# EAGLE design Custom USB_N64_smaller (EAGLE 9.1.3)
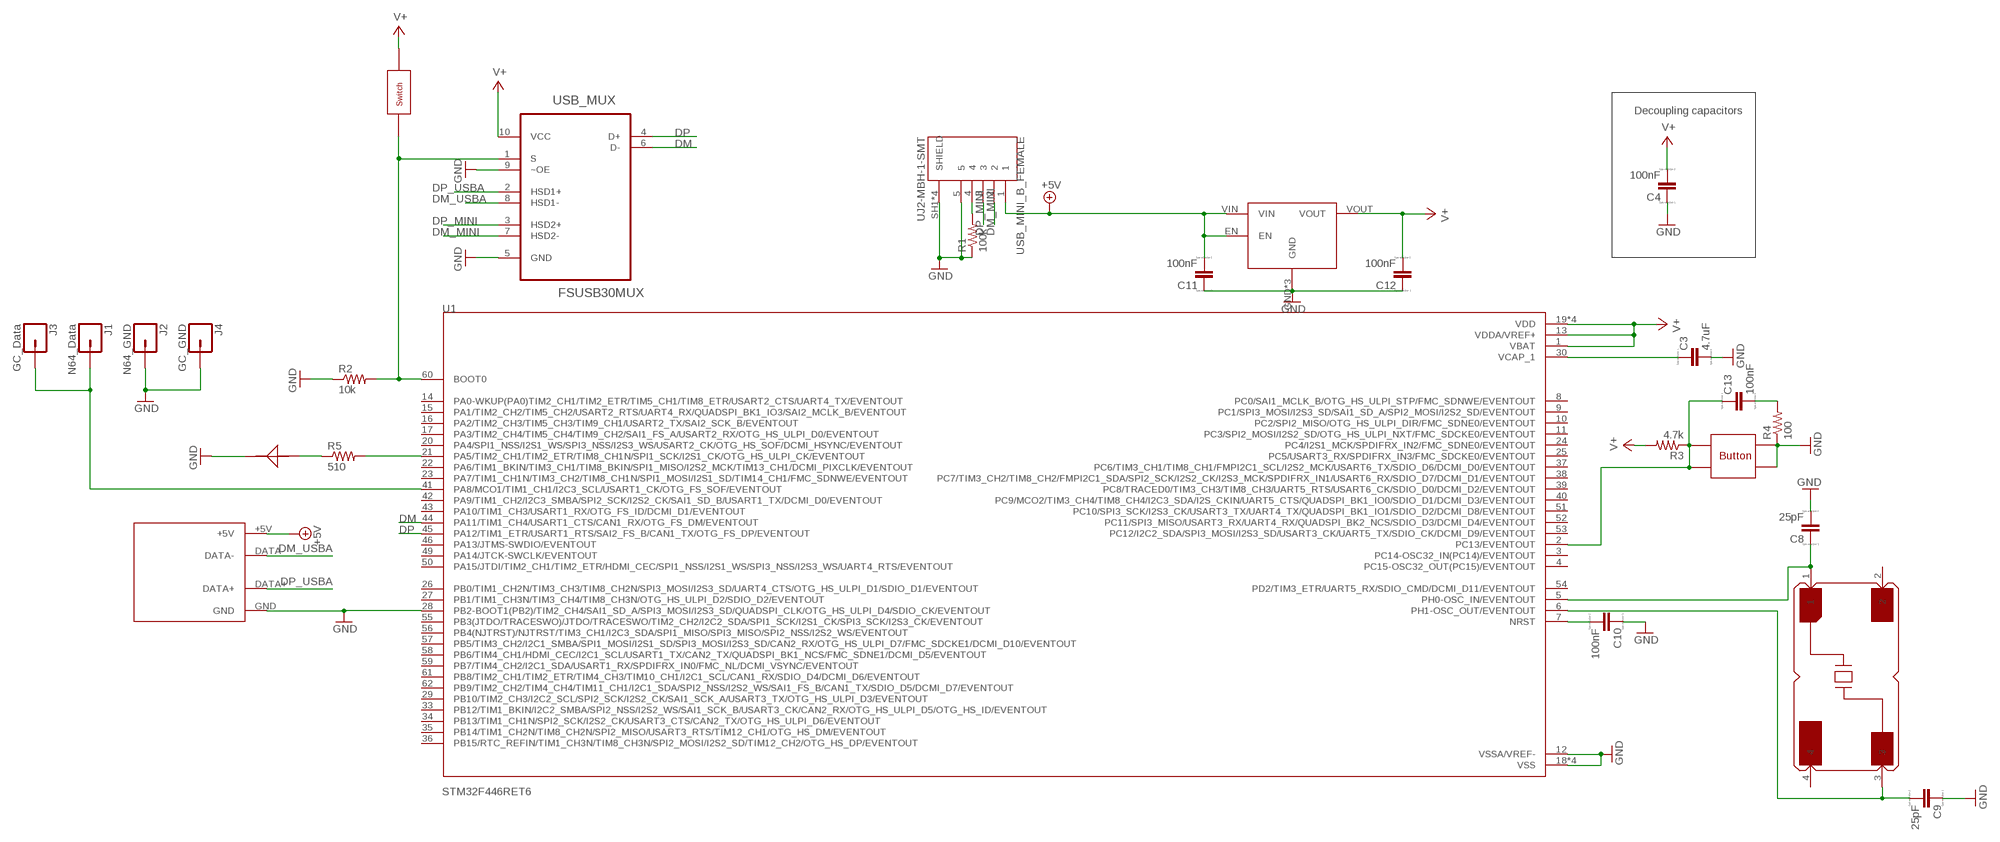
[diagram p0: schematic, sheet 1]

## Parts
C3  4.7uF  C  [C0805]
C4  100nF  C  [C0805]
C8  25pF  C  [C0805]
C9  25pF  C  [C0805]
C10  100nF  C  [C0805]
C11  100nF  C  [C0805]
C12  100nF  C  [C0805]
C13  100nF  C  [C0805]
CHANGE_CONTROLS  PUSHBUTTON  [PUSHBUTTON]
J1  N64_Data  M01PTH  [1X01]
J2  N64_GND  M01PTH  [1X01]
J3  GC_Data  M01PTH  [1X01]
J4  GC_GND  M01PTH  [1X01]
R1  100k  R-US_R0805  [R0805]
R2  10k  R-US_R0805  [R0805]
R3  4.7k  R-US_R0805  [R0805]
R4  100  R-US_R0805  [R0805]
R5  510  R-US_R0805  [R0805]
SWITCH  DM01  [DM01]
U1  STM32F446RET6  [QFP50P1200X1200X160-64N]
U$6  17-21SYGC/S530-E2/TR8  [17-21SYGC/S530-E2/TR8]
USB_A_FEMALE  USB_A_F  [USB_A_F]
USB_MINI_B_FEMALE  UJ2-MBH-1-SMT  [CUI_UJ2-MBH-1-SMT]
USB_MUX  FSUSB30MUX  [SOP50P490X110-10N]
V_REG  S-1172B33-U5T1G  [S-1172B33-U5T1G]
XTAL_HSE  ABMM-8.000MHZ-B2-T  [DFN-4]

## Nets
3V3: C4.2 C12.2 R3.2 SWITCH.P$1 U1.1(VBAT) U1.13(VDDA/VREF+) U1.19(VDD) U1.32(VDD) U1.48(VDD) U1.64(VDD) USB_MUX.10(VCC) V_REG.VOUT ; supply symbol labelled V+
+5V: C11.2 USB_A_FEMALE.+5V USB_MINI_B_FEMALE.1 V_REG.EN V_REG.VIN
DM: U1.44(PA11/TIM1_CH4/USART1_CTS/CAN1_RX/OTG_FS_DM/EVENTOUT) USB_MUX.6(D-)
DM_MINI: USB_MINI_B_FEMALE.2 USB_MUX.7(HSD2-)
DM_USBA: USB_A_FEMALE.DATA- USB_MUX.8(HSD1-)
DP: U1.45(PA12/TIM1_ETR/USART1_RTS/SAI2_FS_B/CAN1_TX/OTG_FS_DP/EVENTOUT) USB_MUX.4(D+)
DP_MINI: USB_MINI_B_FEMALE.3 USB_MUX.3(HSD2+)
DP_USBA: USB_A_FEMALE.DATA+ USB_MUX.2(HSD1+)
GND: C3.2 C4.1 C8.2 C9.1 C10.1 C11.1 C12.1 CHANGE_CONTROLS.P$3 CHANGE_CONTROLS.P$4 J2.1 J4.1 R1.1 R2.1 R4.1 U1.12(VSSA/VREF-) U1.18(VSS) U1.28(PB2-BOOT1(PB2)/TIM2_CH4/SAI1_SD_A/SPI3_MOSI/I2S3_SD/QUADSPI_CLK/OTG_HS_ULPI_D4/SDIO_CK/EVENTOUT) U1.31(VSS) U1.47(VSS) U1.63(VSS) U$6.NEG USB_A_FEMALE.GND USB_MINI_B_FEMALE.5 USB_MINI_B_FEMALE.SH1(SHIELD) USB_MINI_B_FEMALE.SH2(SHIELD) USB_MINI_B_FEMALE.SH3(SHIELD) USB_MINI_B_FEMALE.SH4(SHIELD) USB_MUX.5(GND) USB_MUX.9(~OE) V_REG.GND V_REG.GND2(GND) V_REG.GND3(GND)
N$3: R2.2 SWITCH.P$2 U1.60(BOOT0) USB_MUX.1(S)
N$4: C10.2 U1.7(NRST)
N$5: C8.1 U1.5(PH0-OSC_IN/EVENTOUT) XTAL_HSE.1
N$6: C3.1 U1.30(VCAP_1)
N$7: C9.2 U1.6(PH1-OSC_OUT/EVENTOUT) XTAL_HSE.3
N$8: J1.1 J3.1 U1.41(PA8/MCO1/TIM1_CH1/I2C3_SCL/USART1_CK/OTG_FS_SOF/EVENTOUT)
N$10: C13.1 CHANGE_CONTROLS.P$1 CHANGE_CONTROLS.P$2 R3.1 U1.2(PC13/EVENTOUT)
N$11: R5.2 U1.21(PA5/TIM2_CH1/TIM2_ETR/TIM8_CH1N/SPI1_SCK/I2S1_CK/OTG_HS_ULPI_CK/EVENTOUT)
N$12: C13.2 R4.2
N$13: R5.1 U$6.POS
N$15: R1.2 USB_MINI_B_FEMALE.4
Unconnected: U1.3(PC14-OSC32_IN(PC14)/EVENTOUT) U1.4(PC15-OSC32_OUT(PC15)/EVENTOUT) U1.8(PC0/SAI1_MCLK_B/OTG_HS_ULPI_STP/FMC_SDNWE/EVENTOUT) U1.9(PC1/SPI3_MOSI/I2S3_SD/SAI1_SD_A/SPI2_MOSI/I2S2_SD/EVENTOUT) U1.10(PC2/SPI2_MISO/OTG_HS_ULPI_DIR/FMC_SDNE0/EVENTOUT) U1.11(PC3/SPI2_MOSI/I2S2_SD/OTG_HS_ULPI_NXT/FMC_SDCKE0/EVENTOUT) U1.14(PA0-WKUP(PA0)TIM2_CH1/TIM2_ETR/TIM5_CH1/TIM8_ETR/USART2_CTS/UART4_TX/EVENTOUT) U1.15(PA1/TIM2_CH2/TIM5_CH2/USART2_RTS/UART4_RX/QUADSPI_BK1_IO3/SAI2_MCLK_B/EVENTOUT) U1.16(PA2/TIM2_CH3/TIM5_CH3/TIM9_CH1/USART2_TX/SAI2_SCK_B/EVENTOUT) U1.17(PA3/TIM2_CH4/TIM5_CH4/TIM9_CH2/SAI1_FS_A/USART2_RX/OTG_HS_ULPI_D0/EVENTOUT) U1.20(PA4/SPI1_NSS/I2S1_WS/SPI3_NSS/I2S3_WS/USART2_CK/OTG_HS_SOF/DCMI_HSYNC/EVENTOUT) U1.22(PA6/TIM1_BKIN/TIM3_CH1/TIM8_BKIN/SPI1_MISO/I2S2_MCK/TIM13_CH1/DCMI_PIXCLK/EVENTOUT) U1.23(PA7/TIM1_CH1N/TIM3_CH2/TIM8_CH1N/SPI1_MOSI/I2S1_SD/TIM14_CH1/FMC_SDNWE/EVENTOUT) U1.24(PC4/I2S1_MCK/SPDIFRX_IN2/FMC_SDNE0/EVENTOUT) U1.25(PC5/USART3_RX/SPDIFRX_IN3/FMC_SDCKE0/EVENTOUT) U1.26(PB0/TIM1_CH2N/TIM3_CH3/TIM8_CH2N/SPI3_MOSI/I2S3_SD/UART4_CTS/OTG_HS_ULPI_D1/SDIO_D1/EVENTOUT) U1.27(PB1/TIM1_CH3N/TIM3_CH4/TIM8_CH3N/OTG_HS_ULPI_D2/SDIO_D2/EVENTOUT) U1.29(PB10/TIM2_CH3/I2C2_SCL/SPI2_SCK/I2S2_CK/SAI1_SCK_A/USART3_TX/OTG_HS_ULPI_D3/EVENTOUT) U1.33(PB12/TIM1_BKIN/I2C2_SMBA/SPI2_NSS/I2S2_WS/SAI1_SCK_B/USART3_CK/CAN2_RX/OTG_HS_ULPI_D5/OTG_HS_ID/EVENTOUT) U1.34(PB13/TIM1_CH1N/SPI2_SCK/I2S2_CK/USART3_CTS/CAN2_TX/OTG_HS_ULPI_D6/EVENTOUT) U1.35(PB14/TIM1_CH2N/TIM8_CH2N/SPI2_MISO/USART3_RTS/TIM12_CH1/OTG_HS_DM/EVENTOUT) U1.36(PB15/RTC_REFIN/TIM1_CH3N/TIM8_CH3N/SPI2_MOSI/I2S2_SD/TIM12_CH2/OTG_HS_DP/EVENTOUT) U1.37(PC6/TIM3_CH1/TIM8_CH1/FMPI2C1_SCL/I2S2_MCK/USART6_TX/SDIO_D6/DCMI_D0/EVENTOUT) U1.38(PC7/TIM3_CH2/TIM8_CH2/FMPI2C1_SDA/SPI2_SCK/I2S2_CK/I2S3_MCK/SPDIFRX_IN1/USART6_RX/SDIO_D7/DCMI_D1/EVENTOUT) U1.39(PC8/TRACED0/TIM3_CH3/TIM8_CH3/UART5_RTS/USART6_CK/SDIO_D0/DCMI_D2/EVENTOUT) U1.40(PC9/MCO2/TIM3_CH4/TIM8_CH4/I2C3_SDA/I2S_CKIN/UART5_CTS/QUADSPI_BK1_IO0/SDIO_D1/DCMI_D3/EVENTOUT) U1.42(PA9/TIM1_CH2/I2C3_SMBA/SPI2_SCK/I2S2_CK/SAI1_SD_B/USART1_TX/DCMI_D0/EVENTOUT) U1.43(PA10/TIM1_CH3/USART1_RX/OTG_FS_ID/DCMI_D1/EVENTOUT) U1.46(PA13/JTMS-SWDIO/EVENTOUT) U1.49(PA14/JTCK-SWCLK/EVENTOUT) U1.50(PA15/JTDI/TIM2_CH1/TIM2_ETR/HDMI_CEC/SPI1_NSS/I2S1_WS/SPI3_NSS/I2S3_WS/UART4_RTS/EVENTOUT) U1.51(PC10/SPI3_SCK/I2S3_CK/USART3_TX/UART4_TX/QUADSPI_BK1_IO1/SDIO_D2/DCMI_D8/EVENTOUT) U1.52(PC11/SPI3_MISO/USART3_RX/UART4_RX/QUADSPI_BK2_NCS/SDIO_D3/DCMI_D4/EVENTOUT) U1.53(PC12/I2C2_SDA/SPI3_MOSI/I2S3_SD/USART3_CK/UART5_TX/SDIO_CK/DCMI_D9/EVENTOUT) U1.54(PD2/TIM3_ETR/UART5_RX/SDIO_CMD/DCMI_D11/EVENTOUT) U1.55(PB3(JTDO/TRACESWO)/JTDO/TRACESWO/TIM2_CH2/I2C2_SDA/SPI1_SCK/I2S1_CK/SPI3_SCK/I2S3_CK/EVENTOUT) U1.56(PB4(NJTRST)/NJTRST/TIM3_CH1/I2C3_SDA/SPI1_MISO/SPI3_MISO/SPI2_NSS/I2S2_WS/EVENTOUT) U1.57(PB5/TIM3_CH2/I2C1_SMBA/SPI1_MOSI/I2S1_SD/SPI3_MOSI/I2S3_SD/CAN2_RX/OTG_HS_ULPI_D7/FMC_SDCKE1/DCMI_D10/EVENTOUT) U1.58(PB6/TIM4_CH1/HDMI_CEC/I2C1_SCL/USART1_TX/CAN2_TX/QUADSPI_BK1_NCS/FMC_SDNE1/DCMI_D5/EVENTOUT) U1.59(PB7/TIM4_CH2/I2C1_SDA/USART1_RX/SPDIFRX_IN0/FMC_NL/DCMI_VSYNC/EVENTOUT) U1.61(PB8/TIM2_CH1/TIM2_ETR/TIM4_CH3/TIM10_CH1/I2C1_SCL/CAN1_RX/SDIO_D4/DCMI_D6/EVENTOUT) U1.62(PB9/TIM2_CH2/TIM4_CH4/TIM11_CH1/I2C1_SDA/SPI2_NSS/I2S2_WS/SAI1_FS_B/CAN1_TX/SDIO_D5/DCMI_D7/EVENTOUT) XTAL_HSE.2 XTAL_HSE.4

## Notes on the sheet
- Decoupling capacitors

## Library data of the parts
C3 C4 C8-C13 = eagle-ltspice:C: CAPACITOR, European symbol; SPICEMODEL: NONE; SPICEPREFIX: C
CHANGE_CONTROLS = pushbutton:PUSHBUTTON: LL3301NF065QG
J1-J4 = SparkFun-Connectors:M01: Header 1 Standard 1-pin 0.1" header. Use with straight break away headers (SKU : PRT-00116), right angle break away headers (PRT-00553), swiss pins (PRT-00743), machine pins (PRT-00117), and female headers (PRT-00115). SMTSO-256-ET is a "flush mount" nut for a 4-40 screw. The older package used to be too tight, and did not allow it to sit properly thru the drill hit. The latest (0.165DIA) fits nice and snug.
R1-R5 = rcl:R-US_: RESISTOR, American symbol; SPICEPREFIX: R
SWITCH = DM01:DM01
U1 = STM32F446RET6:STM32F446RET6: MCU 32-Bit STM32 ARM Cortex M4 RISC 512KB Flash 2.5V/3.3V 64-Pin LQFP Tray; DESCRIPTION: MCU 32-Bit STM32 ARM Cortex M4 RISC 512KB Flash 2.5V/3.3V 64-Pin LQFP Tray; MF: STMicroelectronics; MP: STM32F446RET6; PACKAGE: LQFP-64 STMicroelectronics
U$6 = LED_0805:17-21SYGC/S530-E2/TR8
USB_A_FEMALE = nucleo64:USB_A_F
USB_MINI_B_FEMALE = UJ2-MBH-1-SMT:UJ2-MBH-1-SMT: 3 µin Plating Thickness, Black Insulator, USB Receptacle; AVAILABILITY: Good; DESCRIPTION: Conn Mini USB Type B F 5 POS 0.8mm Solder RA SMD 5 Terminal 1 Port T/R; MF: CUI; MP: UJ2-MBH-1-SMT-TR; PACKAGE: None; PRICE: 0.29 USD
USB_MUX = FSUSB30MUX:FSUSB30MUX: Low Power teo port High speed USB 2.0 Switch; AVAILABILITY: Unavailable; DESCRIPTION: FSUSB30 Series DPDT 4.3 V 480 Mbps SMT Hi Speed USB 2.0 Switch - MSOP-10; MF: ON Semiconductor; MP: FSUSB30MUX; PACKAGE: MSOP-10 ON Semiconductor; PRICE: None
V_REG = S-1172B33-U5T1G:S-1172B33-U5T1G
XTAL_HSE = ABMM-8.000MHZ-B2-T:ABMM-8.000MHZ-B2-T: CRYSTAL 24MHZ 18PF SMD; AVAILABILITY: Good; DESCRIPTION: Crystal 8MHz ??20ppm _Tol_ ??50ppm _Stability_ 18pF FUND 70Ohm 4-Pin CSMD T/R; MF: Abracon; MP: ABMM-8.000MHZ-B2-T; PACKAGE: SMD-4 Abracon; PRICE: 0.61 USD

## Board
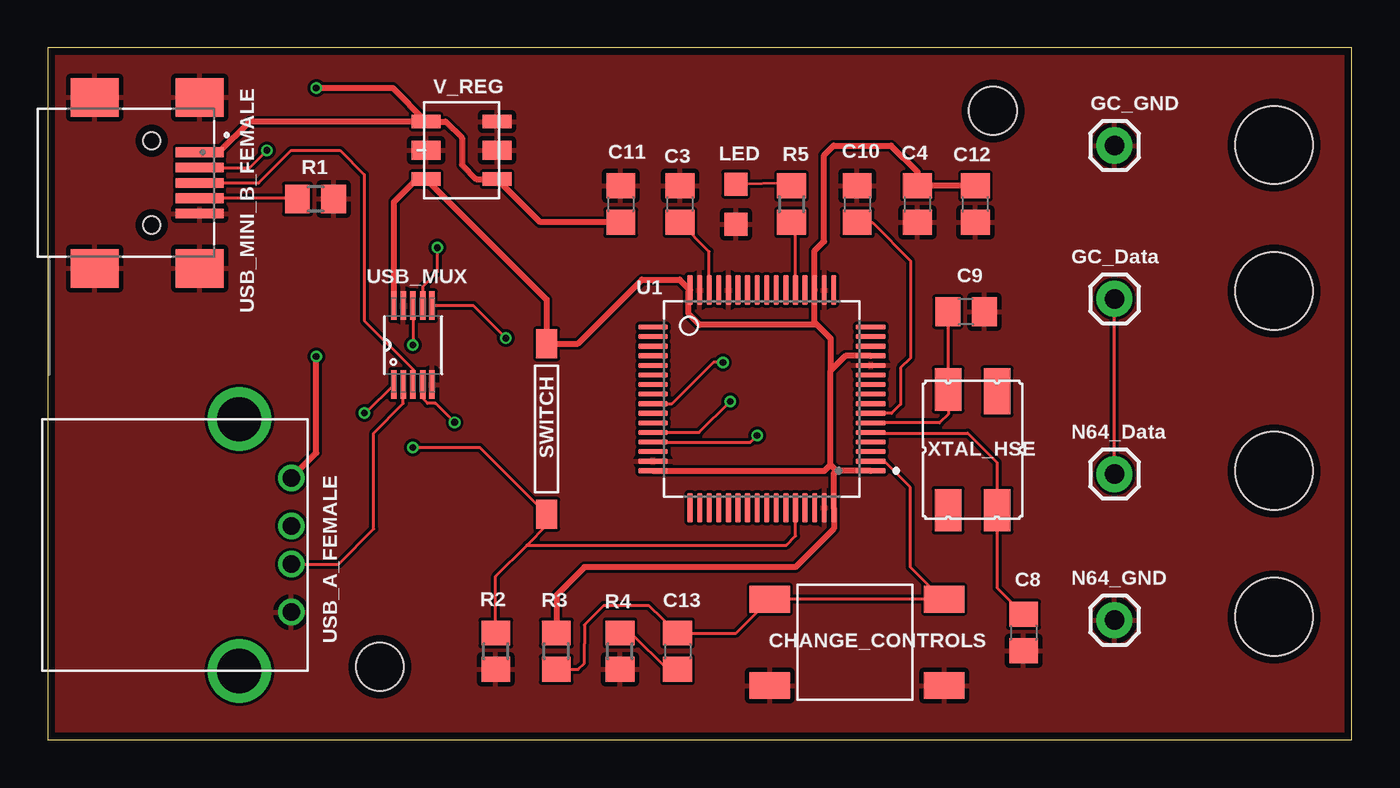
[diagram p1: board, top side]
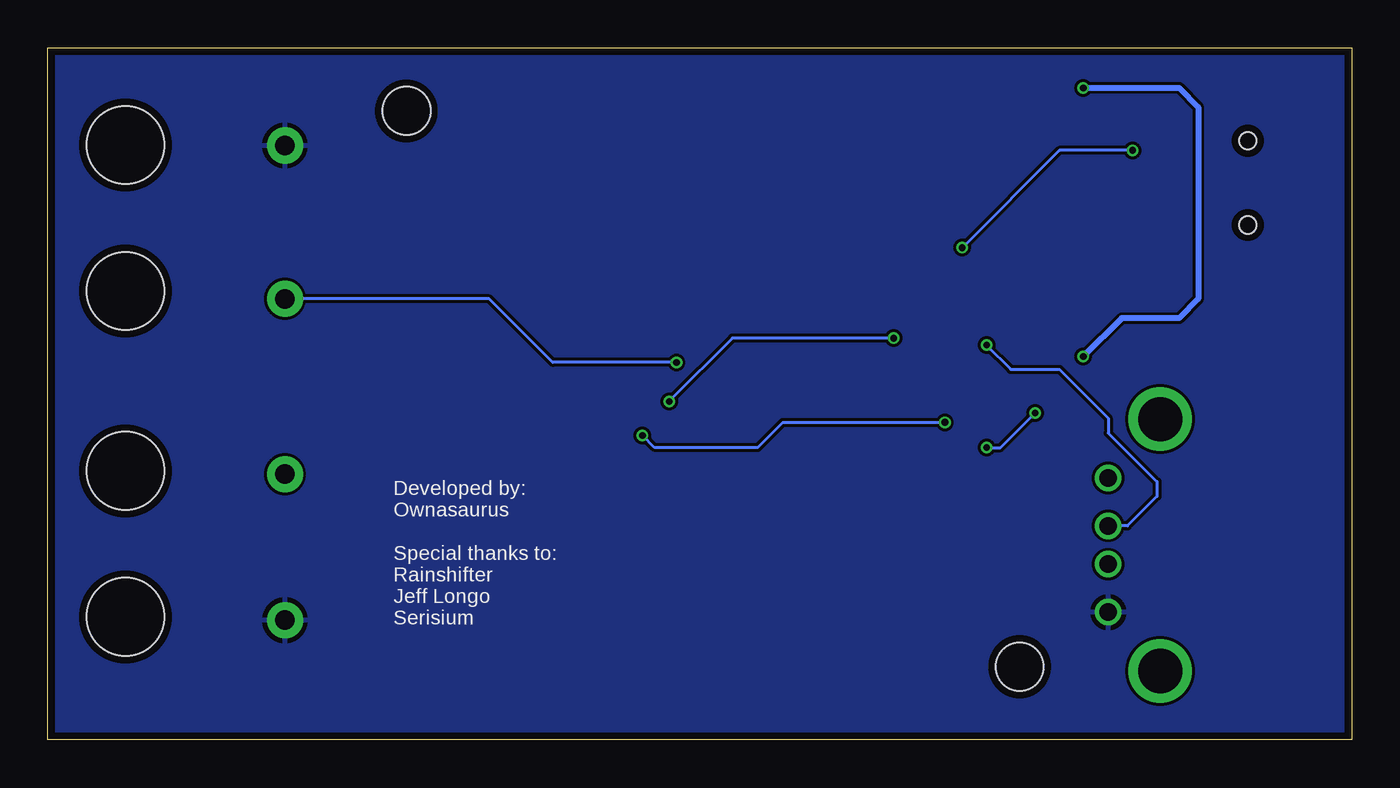
[diagram p2: board, bottom side, seen from below]

Size 68.03 x 36.09 mm. Coordinates in mm from the lower left corner, seen from the top.
Outline: 0,0 68.03,0 68.03,36.09 0,36.09 0,0
Copper layers (1*16): Top 0.035559375mm / dielectric 1.6mm / Bottom 0.035559375mm
Design rules "oshpark-2layer *": minimum track width 6mil, minimum drill 10mil, track to track 6mil, track to pad 6mil, pad to pad 6mil, via to via 6mil, smd to smd 6mil, copper to edge 15mil, drill to drill 6mil, minimum pad ring 5mil, minimum via ring 5mil, stop-mask expansion 2.5mil, vias tented up to drill 25mil, thermal gap 10mil
Holes 4.06 mm at 63.98,6.41 63.98,14.03 63.98,23.41 63.98,31.03
Holes 2.5 mm at 17.32,3.81 49.32,32.81

### Footprints (pad centres in the part's own frame; a part is rotated, then mirrored left to right if it is on the bottom)
C0805 = smd 1.3 x 1.5: 1 -0.95,0; 2 0.95,0
PUSHBUTTON = smd 2.1 x 1.4: P$1 -4.45,2.25; P$2 4.65,2.25; P$3 -4.45,-2.25; P$4 4.65,-2.25
1X01 = drill 1.016 pad 1.88: 1 0,0
R0805 = smd 1.3 x 1.5: 1 -0.95,0; 2 0.95,0
DM01 = smd 1.1 x 1.5: P$1 0,4.45; P$2 0,-4.45
QFP50P1200X1200X160-64N = smd 1.56 x 0.28: 1 -5.68,3.75; 2 -5.68,3.25; 3 -5.68,2.75; 4 -5.68,2.25; 5 -5.68,1.75; 6 -5.68,1.25; 7 -5.68,0.75; 8 -5.68,0.25; 9 -5.68,-0.25; 10 -5.68,-0.75; 11 -5.68,-1.25; 12 -5.68,-1.75; 13 -5.68,-2.25; 14 -5.68,-2.75; 15 -5.68,-3.25; 16 -5.68,-3.75; 33 5.68,-3.75; 34 5.68,-3.25; 35 5.68,-2.75; 36 5.68,-2.25; 37 5.68,-1.75; 38 5.68,-1.25; 39 5.68,-0.75; 40 5.68,-0.25; 41 5.68,0.25; 42 5.68,0.75; 43 5.68,1.25; 44 5.68,1.75; 45 5.68,2.25; 46 5.68,2.75; 47 5.68,3.25; 48 5.68,3.75 | smd 0.28 x 1.56: 17 -3.75,-5.68; 18 -3.25,-5.68; 19 -2.75,-5.68; 20 -2.25,-5.68; 21 -1.75,-5.68; 22 -1.25,-5.68; 23 -0.75,-5.68; 24 -0.25,-5.68; 25 0.25,-5.68; 26 0.75,-5.68; 27 1.25,-5.68; 28 1.75,-5.68; 29 2.25,-5.68; 30 2.75,-5.68; 31 3.25,-5.68; 32 3.75,-5.68; 49 3.75,5.68; 50 3.25,5.68; 51 2.75,5.68; 52 2.25,5.68; 53 1.75,5.68; 54 1.25,5.68; 55 0.75,5.68; 56 0.25,5.68; 57 -0.25,5.68; 58 -0.75,5.68; 59 -1.25,5.68; 60 -1.75,5.68; 61 -2.25,5.68; 62 -2.75,5.68; 63 -3.25,5.68; 64 -3.75,5.68
17-21SYGC/S530-E2/TR8 = smd 1.2 x 1.2: NEG -1.05,0; POS 1.05,0
USB_A_F = drill 0.92: +5V -3.5,0; DATA+ 1,0; DATA- -1,0; GND 3.5,0 | drill 2.3: CLIP1 -6.57,-2.71; CLIP2 6.57,-2.71
CUI_UJ2-MBH-1-SMT = smd 0.5 x 2.5: 1 0,0; 2 0.8,0; 3 1.6,0; 4 2.4,0; 5 3.2,0 | smd 2 x 2.5: SH1 -2.86,0; SH2 6.06,0; SH3 -2.86,-5.48; SH4 6.06,-5.48 | hole 0.9: -0.6,-2.51; 3.8,-2.51
SOP50P490X110-10N = smd 1.499 x 0.279: 1 -2.057,0.991; 2 -2.057,0.508; 3 -2.057,0; 4 -2.057,-0.508; 5 -2.057,-0.991; 6 2.057,-0.991; 7 2.057,-0.508; 8 2.057,0; 9 2.057,0.508; 10 2.057,0.991
S-1172B33-U5T1G = smd 0.7 x 1.5: EN -1.5,-1.85; GND3 1.5,-1.85; VIN 1.5,1.85; VOUT -1.5,1.85 | smd 1 x 1.5: GND 0,-1.85; GND2 0,1.85
DFN-4 = smd 2.2 x 1.4: 1 0.45,1.32; 2 0.45,3.87; 3 6.75,3.87 | smd 2.4 x 1.4: 4 6.65,1.32

### Placement (x,y rotation side)
C3  32.99,27.94 90 top
C4  45.38,27.94 90 top
C8  50.91,5.59 270 top
C9  47.91,22.33 180 top
C10  42.23,27.94 270 top
C11  29.89,27.94 270 top
C12  48.4,27.94 90 top
C13  32.86,4.62 270 top
CHANGE_CONTROLS  42.12,5.08 0 top
J1  55.66,13.86 0 top
J2  55.66,6.24 0 top
J3  55.66,23 0 top
J4  55.66,31 0 top
R1  13.97,28.21 180 top
R2  23.37,4.62 90 top
R3  26.53,4.62 90 top
R4  29.85,4.62 90 top
R5  38.8,27.94 270 top
SWITCH  26.03,16.21 0 top
U1  37.26,17.78 180 top
U$6  35.9,27.94 90 top
USB_A_FEMALE  12.7,10.16 270 top
USB_MINI_B_FEMALE  7.92,30.65 270 top
USB_MUX  19.05,20.59 90 top
V_REG  21.59,30.75 90 top
XTAL_HSE  50.85,11.52 90 top

### Tracks (layer width: path | path; a pad name or v marks a point on that pad's centre or on a via)
3V3
  Top 0.305: U1.13 41.62,20.03 40.84,19.25 | 40.14,21.64 40.84,20.94 40.84,19.25 | 40.14,21.64 40.01,21.77 U1.19 40.01,25.51 40.5,26 40.5,30.5 41,31 44,31 45.38,29.62 C4.2 C12.2 | 40.14,21.64 34.01,21.64 33.44,22.21 33.44,23.39 U1.32 32.97,24 31,24 30.48,23.48 27.66,20.66 SWITCH.P$1 26.03,22.96 V_REG.VOUT 19.25,29.25 18.06,28.06 USB_MUX.10 | 40.84,14.35 40.84,19.25 | 40.84,14.35 40.52,14.03 36,14.03 | U1.48 36,14.03 | U1.1 41.16,14.03 | 41.16,14.03 40.84,14.35 | 41.16,14.03 41.01,13.88 U1.64 41.01,11.01 39,9 28,9 26.53,7.53 R3.2 | 36,14.03
+5V  (via drill 0.35)
  Top 0.305: USB_A_FEMALE.+5V 14,14.96 v14,20 | USB_MINI_B_FEMALE.1 8.92,30.65 10.52,32.25 V_REG.VIN | v14,34 17.99,34 V_REG.VIN | V_REG.VIN 20.75,32.25 21.6,31.4 21.6,30 22.35,29.25 V_REG.EN 25.69,27 29.85,27 C11.2
  Bottom 0.305: v14,34 9,34 8,33 8,23 9,22 12,22 v14,20
DM  (via drill 0.35)
  Top 0.152: U1.44 33.99,16.03 v35.61,17.65 | v23.9,20.95 22.2,22.65 USB_MUX.6
  Bottom 0.152: v23.9,20.95 32.31,20.95 v35.61,17.65
DM_MINI  (via drill 0.35)
  Top 0.152: USB_MINI_B_FEMALE.2 10.53,29.85 v11.43,30.75 | v20.32,25.67 20.32,24.4 19.56,23.64 USB_MUX.7
  Bottom 0.152: v11.43,30.75 15.24,30.75 v20.32,25.67
DM_USBA  (via drill 0.35)
  Top 0.152: USB_MUX.8 v19.05,20.59
  Bottom 0.152: v19.05,20.59 17.78,19.32 15.24,19.32 12.7,16.78 12.7,16 10.16,13.46 10.16,12.7 11.7,11.16 USB_A_FEMALE.DATA-
DP  (via drill 0.35)
  Top 0.152: U1.45 36.66,15.53 v37.01,15.88 | v21.22,16.56 20.23,17.55 19.81,17.55 19.56,17.8 USB_MUX.4
  Bottom 0.152: v37.01,15.88 36.37,15.24 31,15.24 29.68,16.56 v21.22,16.56
DP_MINI
  Top 0.152: USB_MINI_B_FEMALE.3 11,29.05 12.7,30.75 15.24,30.75 16.51,29.48 16.51,21.86 19.05,19.32 USB_MUX.3
DP_USBA
  Top 0.152: USB_A_FEMALE.DATA+ 15.16,9.16 17,11 17,16 18.54,17.54 USB_MUX.2
GND
  pour Bottom: 0,36.1 68.36,36.1 68.36,0 0,0
  pour Top: 0,36.1 68.36,36.1 68.36,0 0,0
N$3  (via drill 0.35)
  Top 0.152: U1.60 39.01,10.64 38.53,10.16 25,10.16 | v16.51,17.05 16.58,17.05 USB_MUX.1 | R2.2 23.37,8.53 25,10.16 | 25,10.16 26.03,11.19 SWITCH.P$2 22.55,15.24 v19.05,15.24
  Bottom 0.152: v16.51,17.05 18.32,15.24 v19.05,15.24
N$4
  Top 0.152: C10.2 43.04,26.96 45,25 45,19.9 44.5,19.4 44.5,17.5 44.03,17.03 U1.7
N$5
  Top 0.152: U1.5 42.97,16 48,16 49.53,14.47 XTAL_HSE.1 49.53,7.92 C8.1
N$6
  Top 0.152: U1.30 34.51,25.47 C3.1
N$7
  Top 0.152: C9.2 46.98,22.31 XTAL_HSE.3 46.98,16.98 46.53,16.53 U1.6
N$8  (via drill 0.35)
  Top 0.152: U1.41 32.56,17.53 34.72,19.68 v35.23,19.68 | J1.1 J3.1
  Bottom 0.152: v35.23,19.68 41.69,19.68 45,23 J3.1
N$10
  Top 0.152: U1.2 43.64,14.53 45,13.17 45,9 46.67,7.33 CHANGE_CONTROLS.P$2 CHANGE_CONTROLS.P$1 35.91,5.57 C13.1 31.36,7 31,7 29,7 28,6 28,5 28,4 27.67,3.67 R3.1
N$11
  Top 0.152: U1.21 39.01,26.78 R5.2
N$12
  Top 0.152: R4.2 30.43,5.57 32.33,3.67 C13.2
N$13
  Top 0.152: R5.1 38.66,29.03 U$6.POS
N$15
  Top 0.152: R1.2 12.98,28.25 USB_MINI_B_FEMALE.4

### Text on the board
tNames: V_REG | LED | SWITCH | XTAL_HSE | CHANGE_CONTROLS
bNames: Developed by: / Ownasaurus / / Special thanks to: / Rainshifter / Jeff Longo / Serisium